# EAGLE schematic NeoDigito Grande V2_0 (EAGLE 9.1.3)
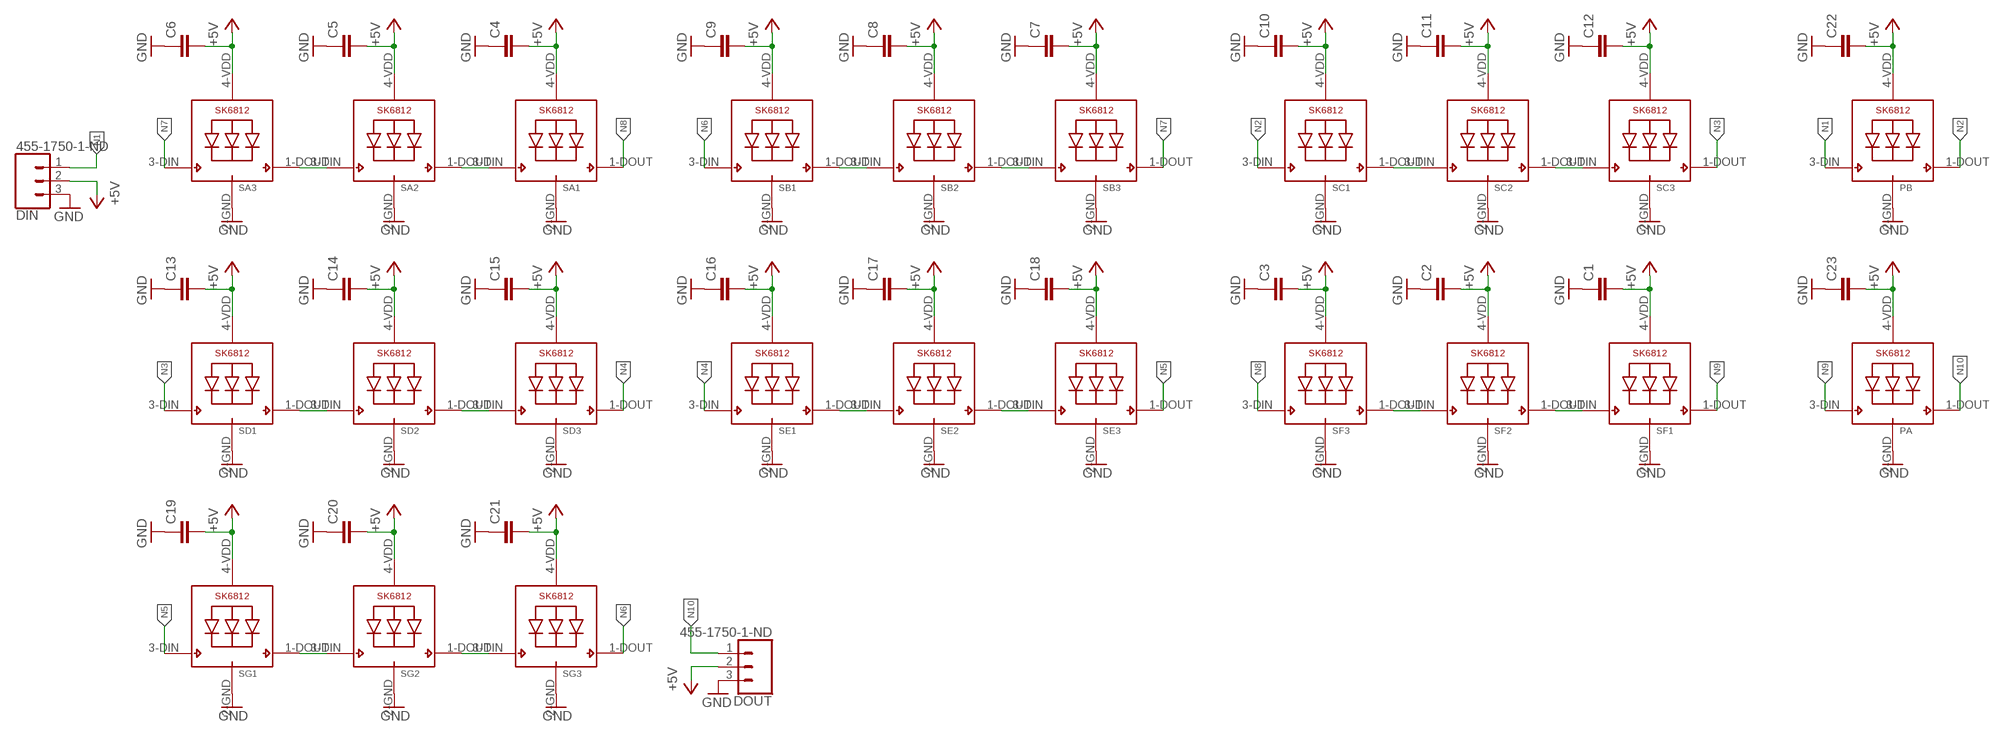
[diagram p0: schematic, sheet 1]

## Parts
C1  C-EUC0805  [C0805]
C2  C-EUC0805  [C0805]
C3  C-EUC0805  [C0805]
C4  C-EUC0805  [C0805]
C5  C-EUC0805  [C0805]
C6  C-EUC0805  [C0805]
C7  C-EUC0805  [C0805]
C8  C-EUC0805  [C0805]
C9  C-EUC0805  [C0805]
C10  C-EUC0805  [C0805]
C11  C-EUC0805  [C0805]
C12  C-EUC0805  [C0805]
C13  C-EUC0805  [C0805]
C14  C-EUC0805  [C0805]
C15  C-EUC0805  [C0805]
C16  C-EUC0805  [C0805]
C17  C-EUC0805  [C0805]
C18  C-EUC0805  [C0805]
C19  C-EUC0805  [C0805]
C20  C-EUC0805  [C0805]
C21  C-EUC0805  [C0805]
C22  C-EUC0805  [C0805]
C23  C-EUC0805  [C0805]
DIN  455-1750-1-ND  CONN_03  [1X03]
DOUT  455-1750-1-ND  CONN_031X03_NO_SILK  [1X03_NO_SILK]
PA  SK6812_3535  [LED3535]
PB  SK6812_3535  [LED3535]
SA1  SK6812_3535  [LED3535]
SA2  SK6812_3535  [LED3535]
SA3  SK6812_3535  [LED3535]
SB1  SK6812_3535  [LED3535]
SB2  SK6812_3535  [LED3535]
SB3  SK6812_3535  [LED3535]
SC1  SK6812_3535  [LED3535]
SC2  SK6812_3535  [LED3535]
SC3  SK6812_3535  [LED3535]
SD1  SK6812_3535  [LED3535]
SD2  SK6812_3535  [LED3535]
SD3  SK6812_3535  [LED3535]
SE1  SK6812_3535  [LED3535]
SE2  SK6812_3535  [LED3535]
SE3  SK6812_3535  [LED3535]
SF1  SK6812_3535  [LED3535]
SF2  SK6812_3535  [LED3535]
SF3  SK6812_3535  [LED3535]
SG1  SK6812_3535  [LED3535]
SG2  SK6812_3535  [LED3535]
SG3  SK6812_3535  [LED3535]

## Nets
+5V: C1.2 C2.2 C3.2 C4.2 C5.2 C6.2 C7.2 C8.2 C9.2 C10.2 C11.2 C12.2 C13.2 C14.2 C15.2 C16.2 C17.2 C18.2 C19.2 C20.2 C21.2 C22.2 C23.2 DIN.2 DOUT.2 PA.4-VDD(VDD) PB.4-VDD(VDD) SA1.4-VDD(VDD) SA2.4-VDD(VDD) SA3.4-VDD(VDD) SB1.4-VDD(VDD) SB2.4-VDD(VDD) SB3.4-VDD(VDD) SC1.4-VDD(VDD) SC2.4-VDD(VDD) SC3.4-VDD(VDD) SD1.4-VDD(VDD) SD2.4-VDD(VDD) SD3.4-VDD(VDD) SE1.4-VDD(VDD) SE2.4-VDD(VDD) SE3.4-VDD(VDD) SF1.4-VDD(VDD) SF2.4-VDD(VDD) SF3.4-VDD(VDD) SG1.4-VDD(VDD) SG2.4-VDD(VDD) SG3.4-VDD(VDD)
GND: C1.1 C2.1 C3.1 C4.1 C5.1 C6.1 C7.1 C8.1 C9.1 C10.1 C11.1 C12.1 C13.1 C14.1 C15.1 C16.1 C17.1 C18.1 C19.1 C20.1 C21.1 C22.1 C23.1 DIN.3 DOUT.3 PA.2-GND(GND) PB.2-GND(GND) SA1.2-GND(GND) SA2.2-GND(GND) SA3.2-GND(GND) SB1.2-GND(GND) SB2.2-GND(GND) SB3.2-GND(GND) SC1.2-GND(GND) SC2.2-GND(GND) SC3.2-GND(GND) SD1.2-GND(GND) SD2.2-GND(GND) SD3.2-GND(GND) SE1.2-GND(GND) SE2.2-GND(GND) SE3.2-GND(GND) SF1.2-GND(GND) SF2.2-GND(GND) SF3.2-GND(GND) SG1.2-GND(GND) SG2.2-GND(GND) SG3.2-GND(GND)
N1: DIN.1 PB.3-DIN(DI)
N2: PB.1-DOUT(DO) SC1.3-DIN(DI)
N3: SC3.1-DOUT(DO) SD1.3-DIN(DI)
N4: SD3.1-DOUT(DO) SE1.3-DIN(DI)
N5: SE3.1-DOUT(DO) SG1.3-DIN(DI)
N6: SB1.3-DIN(DI) SG3.1-DOUT(DO)
N7: SA3.3-DIN(DI) SB3.1-DOUT(DO)
N8: SA1.1-DOUT(DO) SF3.3-DIN(DI)
N9: PA.3-DIN(DI) SF1.1-DOUT(DO)
N10: DOUT.1 PA.1-DOUT(DO)
N$2: SA2.3-DIN(DI) SA3.1-DOUT(DO)
N$3: SA1.3-DIN(DI) SA2.1-DOUT(DO)
N$5: SB1.1-DOUT(DO) SB2.3-DIN(DI)
N$6: SB2.1-DOUT(DO) SB3.3-DIN(DI)
N$7: SC1.1-DOUT(DO) SC2.3-DIN(DI)
N$8: SC2.1-DOUT(DO) SC3.3-DIN(DI)
N$9: SD1.1-DOUT(DO) SD2.3-DIN(DI)
N$10: SD2.1-DOUT(DO) SD3.3-DIN(DI)
N$11: SG1.1-DOUT(DO) SG2.3-DIN(DI)
N$12: SG2.1-DOUT(DO) SG3.3-DIN(DI)
N$13: SE1.1-DOUT(DO) SE2.3-DIN(DI)
N$14: SE2.1-DOUT(DO) SE3.3-DIN(DI)
N$16: SF2.3-DIN(DI) SF3.1-DOUT(DO)
N$17: SF1.3-DIN(DI) SF2.1-DOUT(DO)

## Library data of the parts
C1-C23 = CCV1:C-EU: CAPACITOR, European symbol; SPICEPREFIX: C
DIN = CCV1:CONN_03: Multi connection point. Often used as Generic Header-pin footprint for 0.1 inch spaced/style header connections On any of the 0.1 inch spaced packages, you can populate with these: Break Away Headers - Straight <https://www.sparkfun.com/products/116> (PRT-00116) Break Away Male Headers - Right Angle <https://www.sparkfun.com/products/553> (PRT-00553) Female Headers <https://www.sparkfun.com/products/115> (PRT-00115) Break Away Headers - Machine Pin <https://www.sparkfun.com/products/117> (PRT-00117) Break Away Female Headers - Swiss Machine Pin <https://www.sparkfun.com/products/743> (PRT-00743) Stackable Header - 3 Pin (Female, 0.1") <https://www.sparkfun.com/products/13875> (PRT-13875) For SCREWTERMINALS and SPRING TERMINALS visit here: Screw Terimnals on SparkFun.com <https://www.sparkfun.com/search/results?term=Screw+Terminals> (5mm/3.5mm/2.54mm spacing) This device is also useful as a general connection point to wire up your design to another part of your project. Our various solder wires solder well into these plated through hole pads. Hook-Up Wire - Assortment (Stranded, 22 AWG) <https://www.sparkfun.com/products/11375> (PRT-11375) Hook-Up Wire - Assortment (Solid Core, 22 AWG) <https://www.sparkfun.com/products/11367> (PRT-11367) View the entire wire category on our website here <https://www.sparkfun.com/categories/141> Special notes: Molex polarized connector foot print use with SKU : PRT-08232 with associated crimp pins and housings.; PROD_ID: XXX-00000
DOUT = CCV1:CONN_03: Multi connection point. Often used as Generic Header-pin footprint for 0.1 inch spaced/style header connections On any of the 0.1 inch spaced packages, you can populate with these: Break Away Headers - Straight <https://www.sparkfun.com/products/116> (PRT-00116) Break Away Male Headers - Right Angle <https://www.sparkfun.com/products/553> (PRT-00553) Female Headers <https://www.sparkfun.com/products/115> (PRT-00115) Break Away Headers - Machine Pin <https://www.sparkfun.com/products/117> (PRT-00117) Break Away Female Headers - Swiss Machine Pin <https://www.sparkfun.com/products/743> (PRT-00743) Stackable Header - 3 Pin (Female, 0.1") <https://www.sparkfun.com/products/13875> (PRT-13875) For SCREWTERMINALS and SPRING TERMINALS visit here: Screw Terimnals on SparkFun.com <https://www.sparkfun.com/search/results?term=Screw+Terminals> (5mm/3.5mm/2.54mm spacing) This device is also useful as a general connection point to wire up your design to another part of your project. Our various solder wires solder well into these plated through hole pads. Hook-Up Wire - Assortment (Stranded, 22 AWG) <https://www.sparkfun.com/products/11375> (PRT-11375) Hook-Up Wire - Assortment (Solid Core, 22 AWG) <https://www.sparkfun.com/products/11367> (PRT-11367) View the entire wire category on our website here <https://www.sparkfun.com/categories/141> Special notes: Molex polarized connector foot print use with SKU : PRT-08232 with associated crimp pins and housings.
PA PB SA1-SA3 SB1-SB3 SC1-SC3 SD1-SD3 SE1-SE3 SF1-SF3 SG1-SG3 = CCV1:SK6812